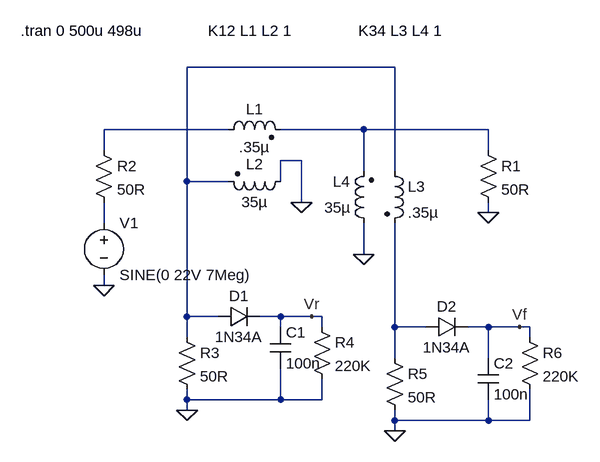
[diagram p0: schematic SWR Bridge Test.asc]
SWR Bridge Test.asc, the LTspice schematic file:
Version 4
SHEET 1 880 680
WIRE 320 -16 0 -16
WIRE 64 80 -128 80
WIRE 272 80 144 80
WIRE 464 80 272 80
WIRE -128 112 -128 80
WIRE 464 112 464 80
WIRE 176 128 144 128
WIRE 272 144 272 80
WIRE 320 144 320 -16
WIRE 0 160 0 -16
WIRE 64 160 0 160
WIRE 144 160 144 128
WIRE 176 192 176 128
WIRE 464 208 464 192
WIRE -128 224 -128 192
WIRE 272 272 272 224
WIRE -128 320 -128 304
WIRE 0 368 0 160
WIRE 48 368 0 368
WIRE 144 368 112 368
WIRE 192 368 144 368
WIRE 208 368 192 368
WIRE 144 384 144 368
WIRE 208 384 208 368
WIRE 320 384 320 224
WIRE 368 384 320 384
WIRE 464 384 432 384
WIRE 512 384 464 384
WIRE 528 384 512 384
WIRE 0 400 0 368
WIRE 528 400 528 384
WIRE 320 432 320 384
WIRE 464 432 464 384
WIRE 0 496 0 480
WIRE 144 496 144 448
WIRE 144 496 0 496
WIRE 208 496 208 464
WIRE 208 496 144 496
WIRE 0 512 0 496
WIRE 320 528 320 512
WIRE 464 528 464 496
WIRE 464 528 320 528
WIRE 528 528 528 480
WIRE 528 528 464 528
WIRE 320 544 320 528
FLAG 464 208 0
FLAG -128 320 0
FLAG 272 272 0
FLAG 176 192 0
FLAG 0 512 0
FLAG 192 368 Vr
FLAG 320 544 0
FLAG 512 384 Vf
SYMBOL ind2 48 96 R270
WINDOW 0 32 56 VTop 2
WINDOW 3 5 56 VBottom 2
SYMATTR InstName L1
SYMATTR Value .35µ
SYMATTR Type ind
SYMBOL ind2 288 240 R180
WINDOW 0 36 80 Left 2
WINDOW 3 36 40 Left 2
SYMATTR InstName L4
SYMATTR Value 35µ
SYMATTR Type ind
SYMBOL res 448 96 R0
SYMATTR InstName R1
SYMATTR Value 50R
SYMBOL voltage -128 208 R0
WINDOW 123 0 0 Left 2
WINDOW 39 0 0 Left 2
SYMATTR InstName V1
SYMATTR Value SINE(0 22V 7Meg)
SYMBOL res -144 96 R0
SYMATTR InstName R2
SYMATTR Value 50R
SYMBOL ind2 160 144 R90
WINDOW 0 5 56 VBottom 2
WINDOW 3 32 56 VTop 2
SYMATTR InstName L2
SYMATTR Value 35µ
SYMATTR Type ind
SYMBOL res -16 384 R0
SYMATTR InstName R3
SYMATTR Value 50R
SYMBOL diode 48 384 R270
WINDOW 0 32 32 VTop 2
WINDOW 3 0 32 VBottom 2
SYMATTR InstName D1
SYMATTR Value 1N34A
SYMBOL cap 128 384 R0
SYMATTR InstName C1
SYMATTR Value 100n
SYMBOL res 192 368 R0
SYMATTR InstName R4
SYMATTR Value 220K
SYMBOL ind2 304 128 R0
SYMATTR InstName L3
SYMATTR Value .35µ
SYMATTR Type ind
SYMBOL res 304 416 R0
SYMATTR InstName R5
SYMATTR Value 50R
SYMBOL diode 368 400 R270
WINDOW 0 32 32 VTop 2
WINDOW 3 0 32 VBottom 2
SYMATTR InstName D2
SYMATTR Value 1N34A
SYMBOL cap 448 432 R0
SYMATTR InstName C2
SYMATTR Value 100n
SYMBOL res 512 384 R0
SYMATTR InstName R6
SYMATTR Value 220K
TEXT -256 -72 Left 2 !.tran 0 500u 498u
TEXT 32 -72 Left 2 !K12 L1 L2 1
TEXT 264 -72 Left 2 !K34 L3 L4 1

The netlist it stands for:
* SWR Bridge Test.asc
L1 N002 N003 .35µ
L4 0 N003 35µ
R1 N003 0 50R
V1 N004 0 SINE(0 22V 7Meg)
R2 N002 N004 50R
L2 0 N001 35µ
R3 N001 0 50R
D1 N001 Vr 1N34A
C1 Vr 0 100n
R4 Vr 0 220K
L3 N001 N005 .35µ
R5 N005 0 50R
D2 N005 Vf 1N34A
C2 Vf 0 100n
R6 Vf 0 220K
.model D D
.lib standard.dio
.tran 0 500u 498u
K12 L1 L2 1
K34 L3 L4 1
.backanno
.end